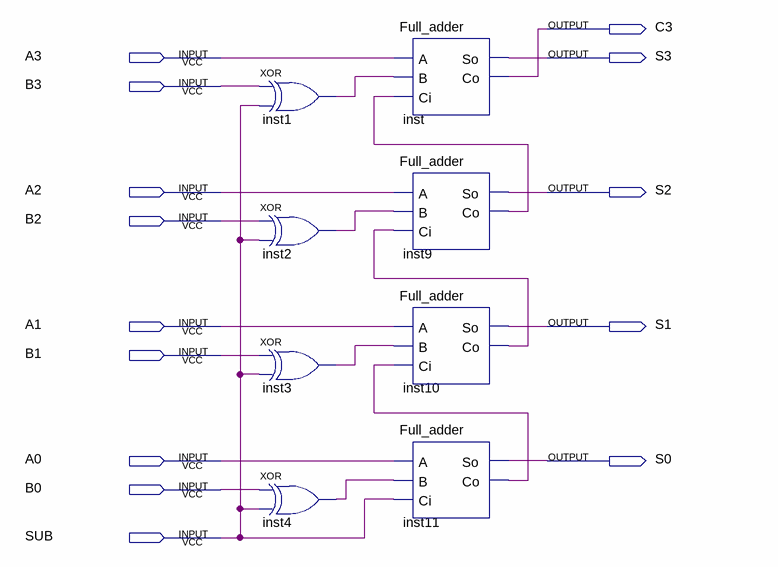
[diagram p0: schematic sheet]
// Quartus schematic 4bit_Add_Sub.bdf as structural Verilog: 8 symbols, 14 pins
module \4bit_Add_Sub  (
  input  A3,
  input  B3,
  input  A2,
  input  B2,
  input  A1,
  input  B1,
  input  A0,
  input  B0,
  input  SUB,
  output C3,
  output S3,
  output S2,
  output S1,
  output S0
);

  wire inst1_out, inst2_out, inst3_out, inst4_out, inst9_co, inst10_co, inst11_co;

  xor inst1 (inst1_out, B3, SUB);
  xor inst2 (inst2_out, B2, SUB);
  xor inst3 (inst3_out, B1, SUB);
  xor inst4 (inst4_out, B0, SUB);
  Full_adder inst (.A(A3), .B(inst1_out), .Ci(inst9_co), .So(S3), .Co(C3));
  Full_adder inst9 (.A(A2), .B(inst2_out), .Ci(inst10_co), .So(S2), .Co(inst9_co));
  Full_adder inst10 (.A(A1), .B(inst3_out), .Ci(inst11_co), .So(S1), .Co(inst10_co));
  Full_adder inst11 (.A(A0), .B(inst4_out), .Ci(SUB), .So(S0), .Co(inst11_co));
endmodule
